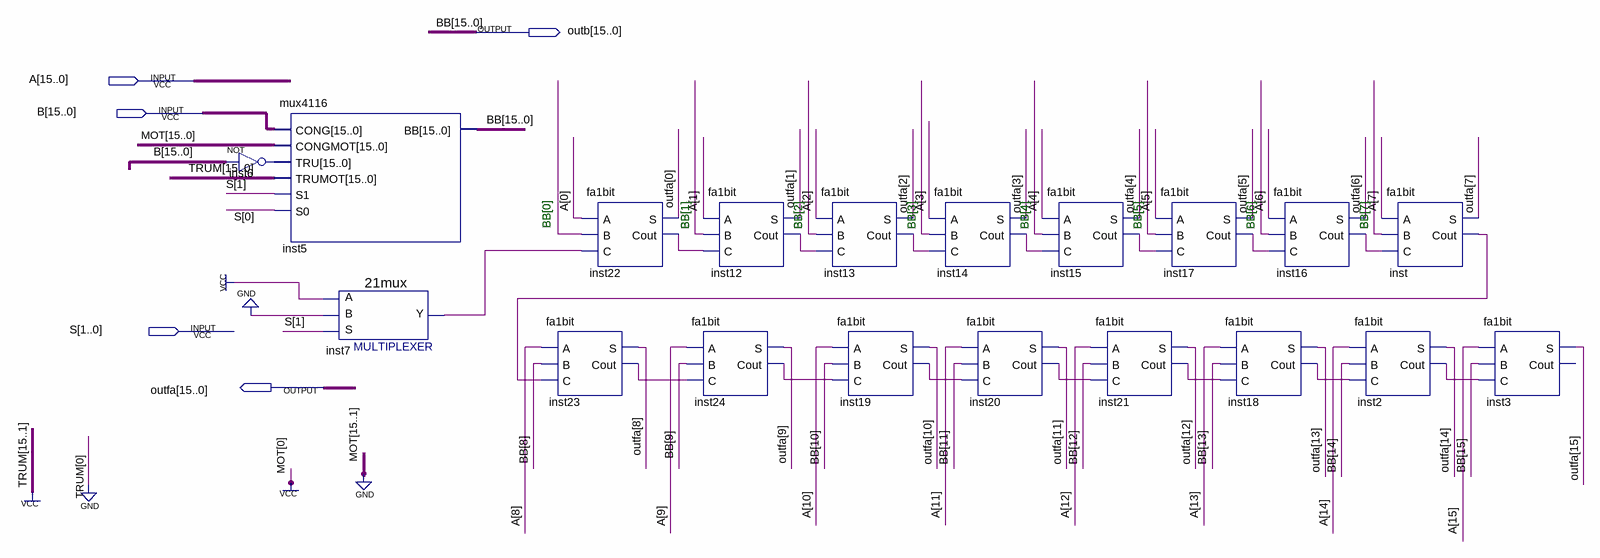
[diagram p0: schematic sheet]
// Quartus schematic AU.bdf as structural Verilog: 19 symbols, 5 pins
module AU (
  input  [15:0] A,
  input  [15:0] B,
  input  [1:0] S,
  output [15:0] outb,
  output [15:0] outfa
);

  wire inst2_cout, inst7_y, inst12_cout, inst13_cout, inst14_cout, inst15_cout, inst16_cout, inst17_cout,
       inst18_cout, inst19_cout, inst20_cout, inst21_cout, inst22_cout, inst23_cout, inst24_cout, inst_cout;
  wire [15:0] inst6_out;

  assign inst6_out = ~B;  // NOT inst6, 16 bits wide
  mux4116 inst5 (
    .CONG(B), .CONGMOT(16'b0000000000000001), .TRU(inst6_out), .TRUMOT(16'b1111111111111110), .S1(S[1]),
    .S0(S[0]), .BB(outb));
  \21mux  inst7 (.S(S[1]), .B(1'b0), .A(1'b1), .Y(inst7_y));
  fa1bit inst22 (.A(A[0]), .B(outb[0]), .C(inst7_y), .S(outfa[0]), .Cout(inst22_cout));
  fa1bit inst23 (.A(A[8]), .B(outb[8]), .C(inst_cout), .S(outfa[8]), .Cout(inst23_cout));
  fa1bit inst12 (.A(A[1]), .B(outb[1]), .C(inst22_cout), .S(outfa[1]), .Cout(inst12_cout));
  fa1bit inst24 (.A(A[9]), .B(outb[9]), .C(inst23_cout), .S(outfa[9]), .Cout(inst24_cout));
  fa1bit inst13 (.A(A[2]), .B(outb[2]), .C(inst12_cout), .S(outfa[2]), .Cout(inst13_cout));
  fa1bit inst19 (.A(A[10]), .B(outb[10]), .C(inst24_cout), .S(outfa[10]), .Cout(inst19_cout));
  fa1bit inst14 (.A(A[3]), .B(outb[3]), .C(inst13_cout), .S(outfa[3]), .Cout(inst14_cout));
  fa1bit inst20 (.A(A[11]), .B(outb[11]), .C(inst19_cout), .S(outfa[11]), .Cout(inst20_cout));
  fa1bit inst15 (.A(A[4]), .B(outb[4]), .C(inst14_cout), .S(outfa[4]), .Cout(inst15_cout));
  fa1bit inst21 (.A(A[12]), .B(outb[12]), .C(inst20_cout), .S(outfa[12]), .Cout(inst21_cout));
  fa1bit inst17 (.A(A[5]), .B(outb[5]), .C(inst15_cout), .S(outfa[5]), .Cout(inst17_cout));
  fa1bit inst18 (.A(A[13]), .B(outb[13]), .C(inst21_cout), .S(outfa[13]), .Cout(inst18_cout));
  fa1bit inst16 (.A(A[6]), .B(outb[6]), .C(inst17_cout), .S(outfa[6]), .Cout(inst16_cout));
  fa1bit inst2 (.A(A[14]), .B(outb[14]), .C(inst18_cout), .S(outfa[14]), .Cout(inst2_cout));
  fa1bit inst (.A(A[7]), .B(outb[7]), .C(inst16_cout), .S(outfa[7]), .Cout(inst_cout));
  fa1bit inst3 (.A(A[15]), .B(outb[15]), .C(inst2_cout), .S(outfa[15]));  // open: Cout

  // Other names for the same wires on the sheet: BB[15:0] = outb

  // Notes on the sheet:
  //   BB[0]
  //   BB[1]
  //   BB[2]
  //   BB[3]
  //   BB[4]
  //   BB[5]
  //   BB[6]
  //   BB[7]
endmodule
